# EAGLE design hbridge (EAGLE 6.3)
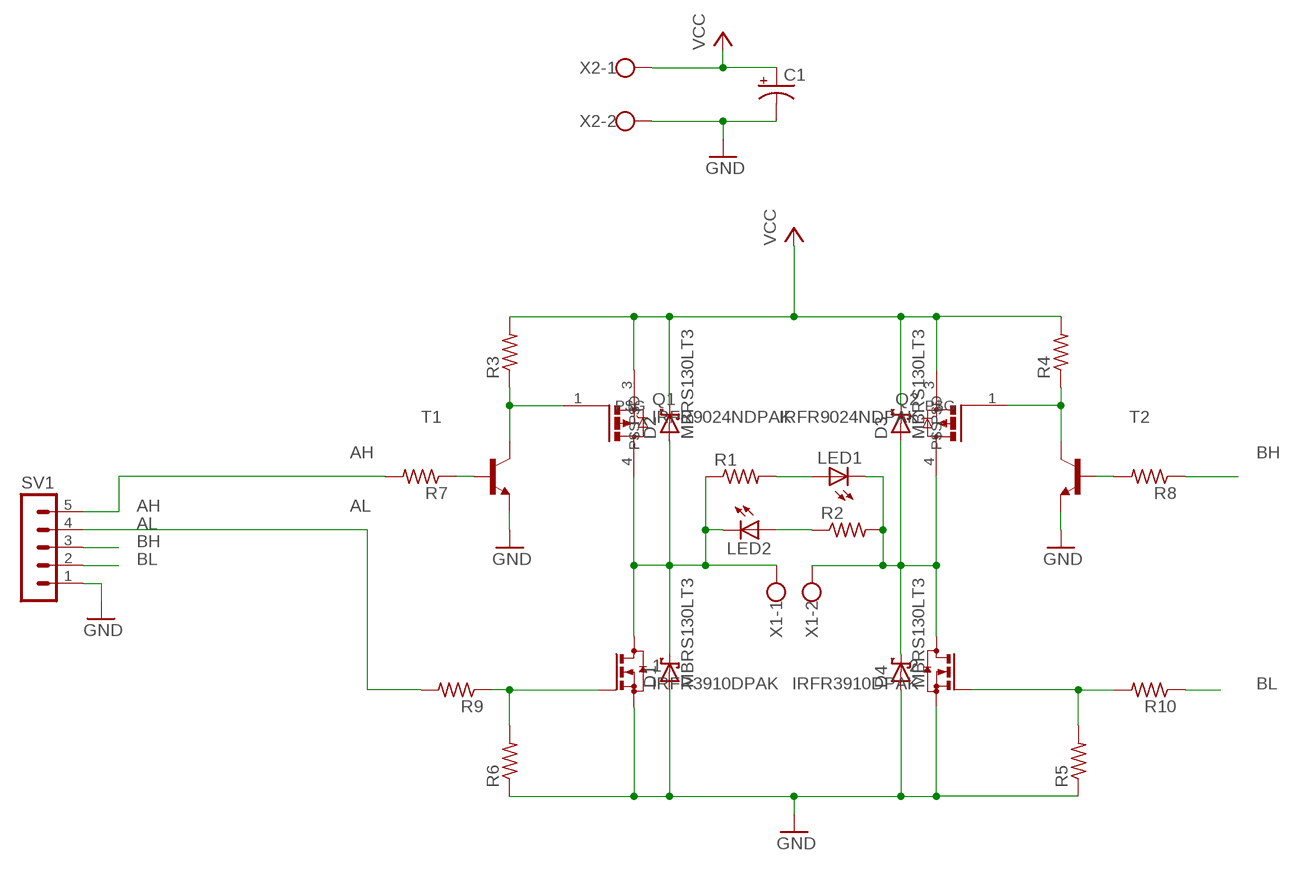
[diagram p0: schematic, sheet 1]

## Parts
1  IRFR3910DPAK  [D-PAK_TO252AA]
2  IRFR3910DPAK  [D-PAK_TO252AA]
C1  CPOL-USE5-10.5  [E5-10,5]
D1  MBRS130LT3  [SMB]
D2  MBRS130LT3  [SMB]
D3  MBRS130LT3  [SMB]
D4  MBRS130LT3  [SMB]
LED1  LEDCHIP-LED0805  [CHIP-LED0805]
LED2  LEDCHIP-LED0805  [CHIP-LED0805]
Q1  IRFR9024NDPAK  [D-PAK_TO252AA]
Q2  IRFR9024NDPAK  [D-PAK_TO252AA]
R1  R-US_R0805  [R0805]
R2  R-US_R0805  [R0805]
R3  R-US_R0805  [R0805]
R4  R-US_R0805  [R0805]
R5  R-US_R0805  [R0805]
R6  R-US_R0805  [R0805]
R7  R-US_R0805  [R0805]
R8  R-US_R0805  [R0805]
R9  R-US_R0805  [R0805]
R10  R-US_R0805  [R0805]
SV1  MA05-1  [MA05-1]
T1  MMBT2222ALT1-NPN-SOT23-BEC  [SOT23-BEC]
T2  MMBT2222ALT1-NPN-SOT23-BEC  [SOT23-BEC]
X1  W237-102  [W237-102]
X2  W237-102  [W237-102]

## Nets
AH: R7.2 SV1.5
AL: R9.2 SV1.4
BH: R8.1 SV1.3
BL: R10.1 SV1.2
GND: 1.3(S) 2.3(S) C1.- D1.A D4.A R5.1 R6.1 SV1.1 T1.E T2.E X2.2
M1: 1.4(D) D1.C D2.A LED2.C Q1.4(P$D) R1.1 X1.1
M2: 2.4(D) D3.A D4.C LED1.C Q2.4(P$D) R2.2 X1.2
N$1: LED2.A R2.1
N$2: LED1.A R1.2
N$4: 1.1(G) R6.2 R9.1
N$6: Q1.1(P$G) R3.1 T1.C
N$7: Q2.1(P$G) R4.1 T2.C
N$9: R7.1 T1.B
N$11: R8.2 T2.B
NS12: 2.1(G) R5.2 R10.2
VCC: C1.+ D2.C D3.C Q1.3(P$S) Q2.3(P$S) R3.2 R4.2 X2.1

## Library data of the parts
1 2 = RobThePyro:IRFR3910: http://www.irf.com/product-info/datasheets/data/irfr3910.pdf
C1 = resistor:CPOL-US: POLARIZED CAPACITOR, American symbol
D1-D4 = diode:MBRS130LT3: Schottky Power Rectifier Source: http://www.onsemi.com/pub/Collateral/MBRS130LT3-D.PDF
LED1 LED2 = led:LED: LED OSRAM: - CHIPLED LG R971, LG N971, LY N971, LG Q971, LY Q971, LO R971, LY R971 LH N974, LH R974 LS Q976, LO Q976, LY Q976 LO Q996 - Hyper CHIPLED LW Q18S LB Q993, LB Q99A, LB R99A - SideLED LS A670, LO A670, LY A670, LG A670, LP A670 LB A673, LV A673, LT A673, LW A673 LH A674 LY A675 LS A676, LA A676, LO A676, LY A676, LW A676 LS A679, LY A679, LG A679 - Hyper Micro SIDELED® LS Y876, LA Y876, LO Y876, LY Y876 LT Y87S - SmartLED LW L88C, LW L88S LB L89C, LB L89S, LG L890 LS L89K, LO L89K, LY L89K LS L896, LA L896, LO L896, LY L896 - TOPLED LS T670, LO T670, LY T670, LG T670, LP T670 LSG T670, LSP T670, LSY T670, LOP T670, LYG T670 LG T671, LOG T671, LSG T671 LB T673, LV T673, LT T673, LW T673 LH T674 LS T676, LA T676, LO T676, LY T676, LB T676, LH T676, LSB T676, LW T676 LB T67C, LV T67C, LT T67C, LS T67K, LO T67K, LY T67K, LW E67C LS E67B, LA E67B, LO E67B, LY E67B, LB E67C, LV E67C, LT E67C LW T67C LS T679, LY T679, LG T679 LS T770, LO T770, LY T770, LG T770, LP T770 LB T773, LV T773, LT T773, LW T773 LH T774 LS E675, LA E675, LY E675, LS T675 LS T776, LA T776, LO T776, LY T776, LB T776 LHGB T686 LT T68C, LB T68C - Hyper Mini TOPLED® LB M676 - Mini TOPLED Santana® LG M470 LS M47K, LO M47K, LY M47K Source: http://www.osram.convergy.de LUXEON: - LUMILED® LXK2-PW12-R00, LXK2-PW12-S00, LXK2-PW14-U00, LXK2-PW14-V00 LXK2-PM12-R00, LXK2-PM12-S00, LXK2-PM14-U00 LXK2-PE12-Q00, LXK2-PE12-R00, LXK2-PE12-S00, LXK2-PE14-T00, LXK2-PE14-U00 LXK2-PB12-K00, LXK2-PB12-L00, LXK2-PB12-M00, LXK2-PB14-N00, LXK2-PB14-P00, LXK2-PB14-Q00 LXK2-PR12-L00, LXK2-PR12-M00, LXK2-PR14-Q00, LXK2-PR14-R00 LXK2-PD12-Q00, LXK2-PD12-R00, LXK2-PD12-S00 LXK2-PH12-R00, LXK2-PH12-S00 LXK2-PL12-P00, LXK2-PL12-Q00, LXK2-PL12-R00 Source: www.luxeon.com KINGBRIGHT: KA-3528ASYC Source: www.kingbright.com
Q1 Q2 = RobThePyro:IRFR9024N: http://www.irf.com/product-info/datasheets/data/irfr9024n.pdf
R1-R10 = resistor:R-US_: RESISTOR, American symbol
SV1 = con-lstb:MA05-1: PIN HEADER; OC_FARNELL: unknown; OC_NEWARK: unknown
T1 T2 = transistor:*-NPN-: NPN Transistror BF959 corrected 2008.03.06
X1 X2 = con-wago-500:W237-102: WAGO SCREW CLAMP; MPN: 237-102; OC_FARNELL: unknown; OC_NEWARK: 70K9898

## Board
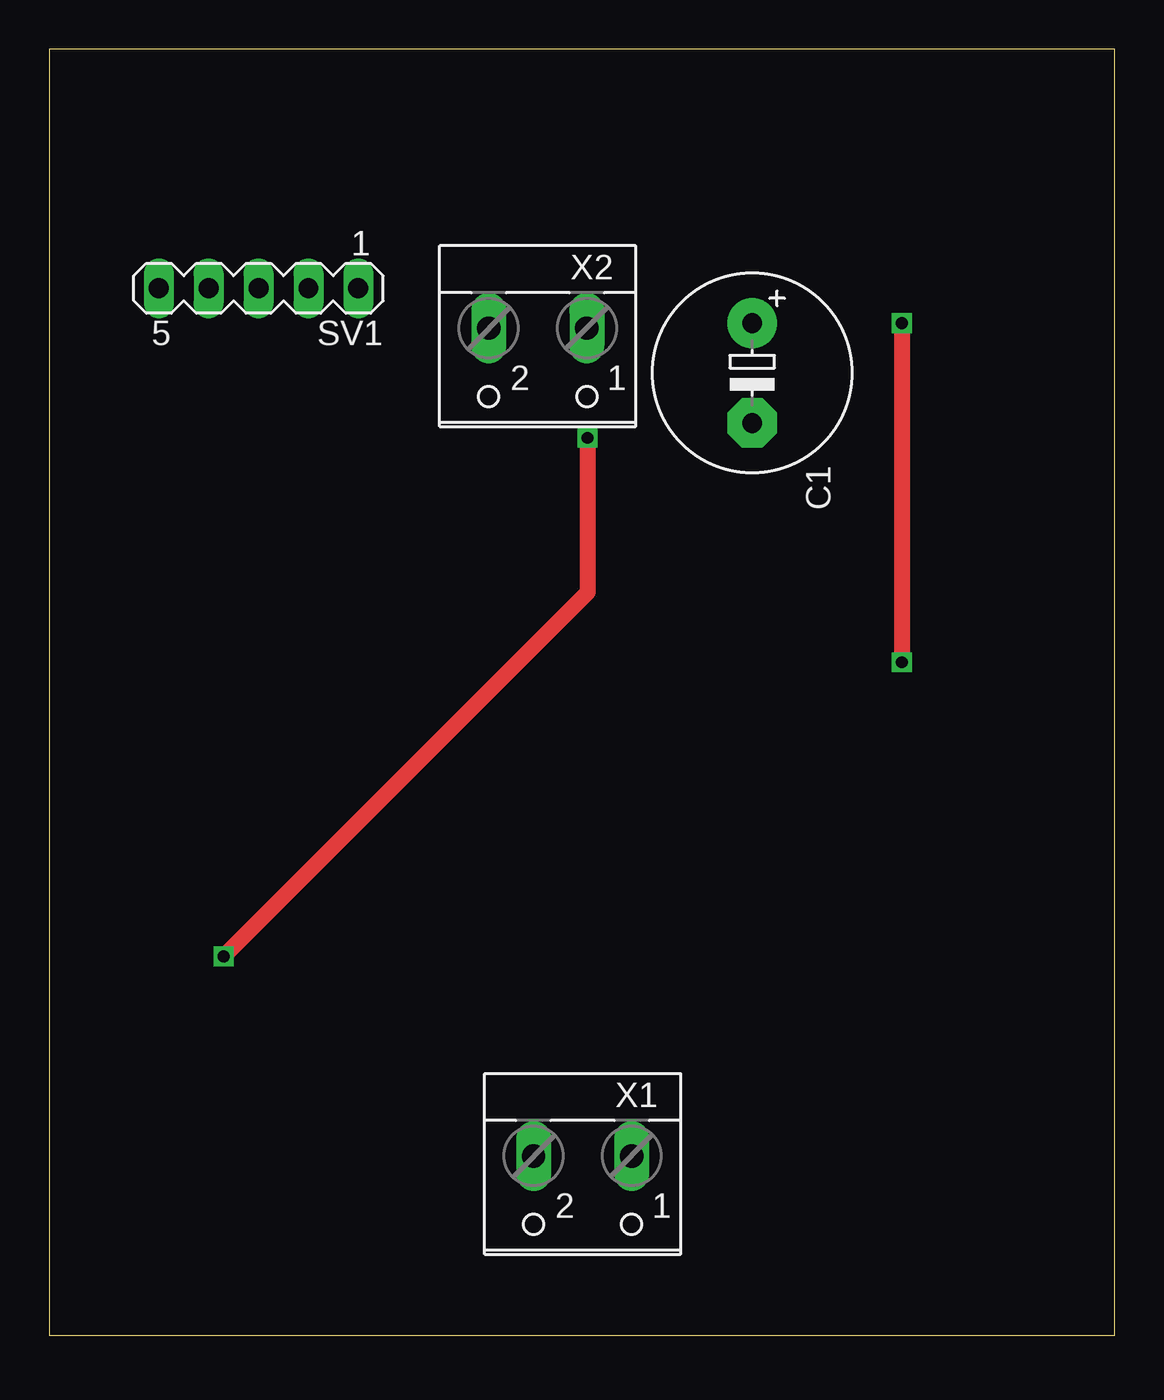
[diagram p1: board, top side]
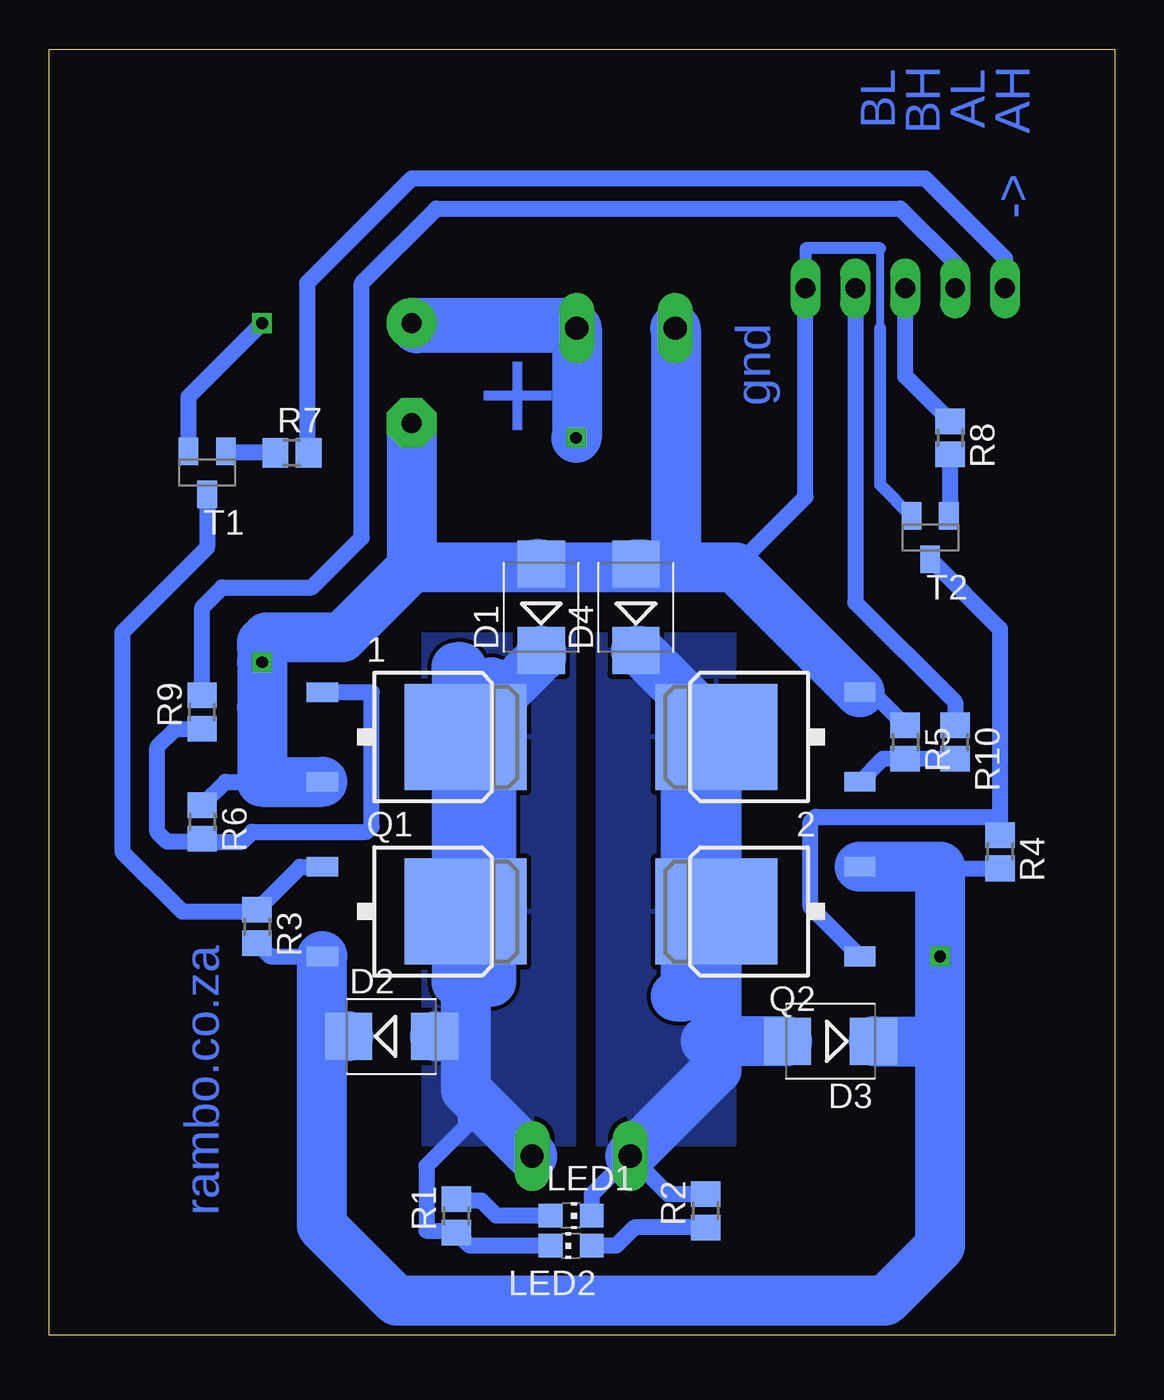
[diagram p2: board, bottom side, seen from below]

Size 54.28 x 65.52 mm. Coordinates in mm from the lower left corner, seen from the top.
Outline: 0,0 54.28,0 54.28,65.52 0,65.52 0,0
Copper layers (1*16): Top 0.035mm / dielectric 1.5mm / Bottom 0.035mm
Design rules "default": minimum track width 10mil, minimum drill 24mil, track to track 8mil, track to pad 8mil, pad to pad 8mil, via to via 8mil, smd to smd 8mil, copper to edge 40mil, drill to drill 8mil, minimum pad ring 10mil, minimum via ring 8mil, stop-mask expansion 4mil, vias tented up to drill 0mil, thermal gap 10mil

### Footprints (pad centres in the part's own frame; a part is rotated, then mirrored left to right if it is on the bottom)
D-PAK_TO252AA = smd 1 x 1.6: 1 -2.28,-4.8; 3 2.28,-4.8 | smd 5.4 x 6.2: 4 0,2.5
E5-10,5 = drill 1.016 pad 2.54: + -2.54,0 | drill 1.016 pad 2.54 octagon: - 2.54,0
SMB = smd 2.4 x 2.4: A 2.2,0; C -2.2,0
CHIP-LED0805 = smd 1.2 x 1.2: A 0,-1.05; C 0,1.05
R0805 = smd 1.3 x 1.5: 1 -0.85,0; 2 0.85,0
MA05-1 = drill 1.016 long: 1 -5.08,0; 2 -2.54,0; 3 0,0; 4 2.54,0; 5 5.08,0
SOT23-BEC = smd 1 x 1.4: B -0.95,-1.1; C 0,1.1; E 0.95,-1.1
W237-102 = drill 1.194 long: 1 -2.5,-1.27; 2 2.5,-1.27

### Placement (x,y rotation side)
1  35.56,30.48 270 bottom
2  17.78,30.48 90 bottom
C1  35.81,49.02 270 top
D1  29.21,37.08 90 bottom
D2  36.83,15.24 0 bottom
D3  14.48,14.99 180 bottom
D4  24.38,37.08 90 bottom
LED1  27.69,6.1 270 bottom
LED2  27.69,4.57 90 bottom
Q1  35.56,21.59 270 bottom
Q2  17.78,21.59 90 bottom
R1  33.53,6.1 90 bottom
R2  20.83,6.35 90 bottom
R3  43.69,20.83 270 bottom
R4  5.84,24.64 270 bottom
R5  10.67,30.23 270 bottom
R6  46.48,26.16 270 bottom
R7  41.91,44.96 0 bottom
R8  8.38,45.72 270 bottom
R9  46.48,31.75 90 bottom
R10  8.13,30.23 270 bottom
SV1  10.67,53.34 180 top
T1  46.23,43.94 180 bottom
T2  9.4,40.64 180 bottom
X1  27.18,7.87 180 top
X2  24.89,50.04 180 top

### Tracks (layer width: path | path; a pad name or v marks a point on that pad's centre or on a via)
AH
  Bottom 0.813: SV1.5 5.59,54.86 9.65,58.93 35.81,58.93 41.15,53.59 41.15,45.05 R7.2
AL
  Bottom 0.813: R9.2 46.48,37.08 45.47,38.1 40.89,38.1 38.35,40.64 38.35,53.59 34.54,57.4 10.92,57.4 8.13,54.61 SV1.4
BH
  Bottom 0.813: R8.1 10.67,48.86 SV1.3
BL
  Bottom 0.813: SV1.2 13.21,37.34 8.13,32.26 R10.1
GND  (via drill 0.6)
  Top 0.813: v43.43,51.56 v43.43,34.29
  Bottom 0.406: 11.94,51.31 11.94,55.37
  Bottom 0.61: T2.E 11.94,43.33 11.94,51.31 | 11.94,55.37 15.75,55.37 SV1.1
  Bottom 0.813: R5.1 12.35,32.76 2.3 | R6.1 45.29,28.2 43.18,28.2 | 13.88,33.77 13.99,33.77 | 19.34,39.12 15.75,42.7 SV1.1 | T1.E 47.18,47.82 v43.43,51.56 | v43.43,34.29 43.43,33.27 43.69,33.02
  Bottom 2.54: C1.- 35.81,39.12 | 35.81,39.12 39.37,35.56 43.18,35.56 43.43,35.31 43.43,35.05 v43.43,34.29 43.43,32 43.43,28.19 43.43,28.2 43.18,28.2 1.3 | 2.3 13.99,33.77 19.34,39.12 22.35,39.12 | 22.35,39.12 23.88,39.12 | 23.88,39.12 29.72,39.12 | 29.72,39.12 35.81,39.12 | X2.2 22.35,51.27 22.35,39.12 | D4.A 24.04,39.28 23.88,39.12 | D1.A 29.55,39.28 29.72,39.12
M1
  Bottom 0.813: LED2.C 32.85,4.57 R1.1 33.62,5.33 35.05,5.33 35.05,8.64 33.06,10.63 33.06,12.53
  Bottom 2.54: 1.4 Q1.4 | Q1.4 33.06,20.87 33.02,20.83 33.02,21.55 Q1.4 | Q1.4 33.06,15.24 | 33.06,15.24 33.06,12.53 X1.1 | D2.A 33.06,15.24 | D1.C 29.21,34.54 33.78,29.97
  pour Bottom: 27.94,9.65 27.43,9.65 27.43,35.81 35.31,35.81 35.31,9.65
M2
  Bottom 0.813: R2.2 22.73,7.2 X1.2 26.64,7.19 LED1.C
  Bottom 2.54: 2.4 Q2.4 20.28,14.99 | 20.28,14.99 20.28,13.54 X1.2 | D3.A 20.28,14.99 | 20.83,14.99 20.28,14.99 | D4.C 24.22,34.88 19.56,30.23
  pour Bottom: 19.3,35.81 19.3,9.65 26.42,9.65 26.42,35.31 26.42,35.81
N$1
  Bottom 0.813: R2.1 24.47,5.5 25.4,4.57 LED2.A
N$2
  Bottom 0.813: LED1.A 31.5,6.1 32.26,6.86 33.44,6.86 R1.2
N$3
  Bottom 2.54: 22.35,17.27 21.84,17.27 21.84,32.26
N$4
  Bottom 0.813: 1.1 37.85,32.76 37.85,32.77 37.85,25.91 38.1,25.65 43.94,25.65 44.45,25.15 46.32,25.15 R6.2 46.65,25.15 48.26,25.15 48.77,25.65 48.77,29.97 47.84,30.9 R9.1
N$5
  Bottom 2.54: 33.27,34.04 33.53,34.04 33.53,18.03 31.75,18.03 31.75,33.27
N$6
  Bottom 0.813: R3.1 41.5,23.87 Q1.1 | R3.1 | T1.C 46.23,40.13 50.55,35.81 50.55,24.64 47.5,21.59 43.78,21.59 R3.1
N$7
  Bottom 0.813: Q2.1 15.49,21.82 15.49,26.16 15.24,26.42 5.84,26.42 | 5.84,26.42 R4.1 | T2.C 5.84,35.98 5.84,26.42
N$9
  Bottom 0.813: R7.1 45.19,44.96 T1.B
N$11
  Bottom 0.813: T2.B 8.38,41.81 R8.2
NS12
  Bottom 0.813: 2.1 11.8,29.38 R5.2 R10.2
VCC  (via drill 0.6)
  Top 0.813: v27.43,45.72 27.43,37.85 v8.89,19.3
  Bottom 0.813: R3.2 43.02,19.31 Q1.3 | 8.9,23.87 8.81,23.79 R4.2
  Bottom 2.54: Q1.3 40.39,19.28 40.39,15.24 | 40.39,15.24 40.39,5.59 36.58,1.78 11.68,1.78 8.89,4.57 8.89,15.24 | 8.89,15.24 v8.89,19.3 8.89,23.88 8.9,23.87 Q2.3 | X2.1 27.65,51.56 C1.+ 35.56,51.31 X2.1 | D3.C 9.14,14.99 8.89,15.24 | D2.C 40.39,15.24 | X2.1 27.39,45.76 v27.43,45.72

### Text on the board
Bottom: AL | BL | AH | BH | -> | gnd | + | rambo.co.za